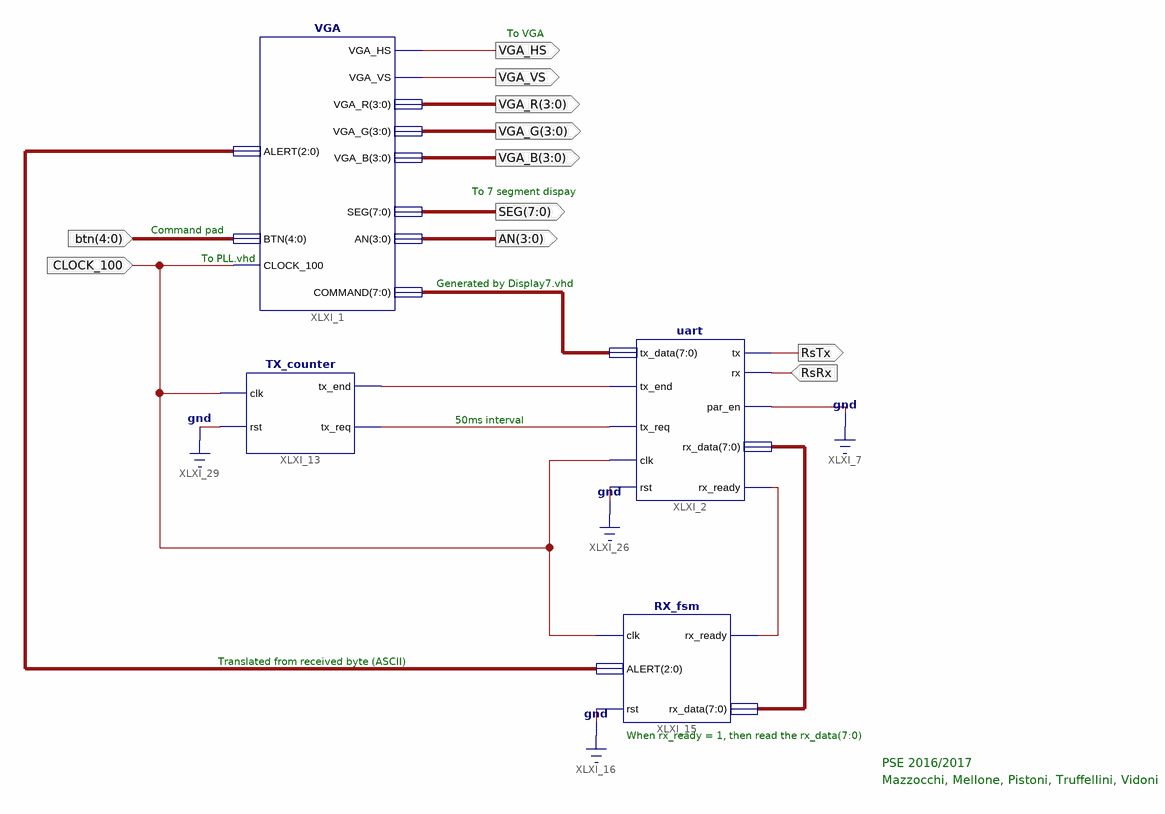
[diagram p0: schematic sheet 1]
// Xilinx ISE schematic vga_uart.sch (spartan6) as structural Verilog: 4 symbols, 11 ports
module vga_uart (
  input  [4:0] btn,
  input  RsRx,
  input  CLOCK_100,
  output VGA_HS,
  output VGA_VS,
  output [3:0] VGA_R,
  output [3:0] VGA_G,
  output [3:0] VGA_B,
  output [7:0] SEG,
  output [3:0] AN,
  output RsTx
);

  wire XLXN_104, XLXN_105, XLXN_112;
  wire [2:0] XLXN_59;
  wire [7:0] XLXN_79, XLXN_92;

  VGA XLXI_1 (
    .CLOCK_100(CLOCK_100), .BTN(btn), .VGA_HS(VGA_HS), .VGA_VS(VGA_VS), .VGA_R(VGA_R), .VGA_G(VGA_G),
    .VGA_B(VGA_B), .SEG(SEG), .AN(AN), .COMMAND(XLXN_79), .ALERT(XLXN_59));
  uart XLXI_2 (
    .tx(RsTx), .rx(RsRx), .par_en(1'b0), .rx_data(XLXN_92), .rx_ready(XLXN_112), .tx_data(XLXN_79),
    .tx_end(XLXN_104), .tx_req(XLXN_105), .rst(1'b0), .clk(CLOCK_100));
  RX_fsm XLXI_15 (.rx_data(XLXN_92), .rst(1'b0), .clk(CLOCK_100), .rx_ready(XLXN_112), .ALERT(XLXN_59));
  TX_counter XLXI_13 (.tx_req(XLXN_105), .tx_end(XLXN_104), .rst(1'b0), .clk(CLOCK_100));

  // Notes on the sheet:
  //   To VGA
  //   To 7 segment dispay
  //   Command pad
  //   To PLL.vhd
  //   Generated by Display7.vhd
  //   50ms interval
  //   Translated from received byte (ASCII)
  //   When rx_ready = 1, then read the rx_data(7:0)
  //   PSE 2016/2017
  //   Mazzocchi, Mellone, Pistoni, Truffellini, Vidoni
endmodule
